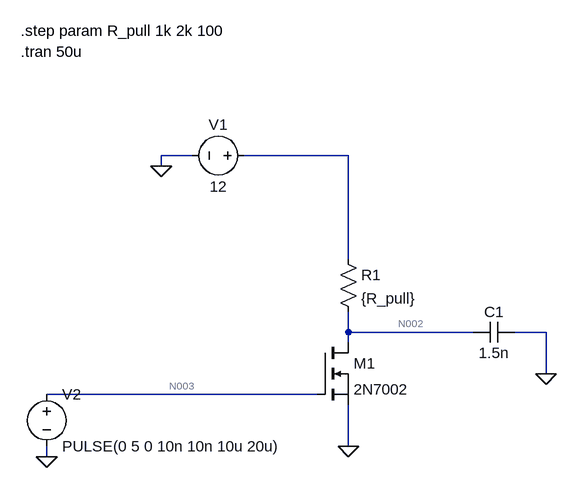
[diagram p0: schematic level_shifter.asc]
level_shifter.asc, the LTspice schematic file:
Version 4.1
SHEET 1 880 680
WIRE 0 64 -48 64
WIRE 240 64 80 64
WIRE -48 80 -48 64
WIRE 240 224 240 64
WIRE 240 336 240 304
WIRE 432 336 240 336
WIRE 544 336 496 336
WIRE 240 352 240 336
WIRE 544 400 544 336
WIRE 192 432 -224 432
WIRE 240 512 240 448
WIRE -224 528 -224 512
FLAG -48 80 0
FLAG -224 528 0
FLAG 240 512 0
FLAG 544 400 0
SYMBOL voltage 96 64 R90
WINDOW 0 -32 56 VBottom 2
WINDOW 3 32 56 VTop 2
WINDOW 123 0 0 Left 0
WINDOW 39 0 0 Left 0
SYMATTR InstName V1
SYMATTR Value 12
SYMBOL voltage -224 416 R0
WINDOW 123 0 0 Left 0
WINDOW 39 0 0 Left 0
SYMATTR InstName V2
SYMATTR Value PULSE(0 5 0 10n 10n 10u 20u)
SYMBOL nmos 192 352 R0
SYMATTR InstName M1
SYMATTR Value 2N7002
SYMBOL res 224 208 R0
SYMATTR InstName R1
SYMATTR Value {R_pull}
SYMBOL cap 496 320 R90
WINDOW 0 0 32 VBottom 2
WINDOW 3 32 32 VTop 2
SYMATTR InstName C1
SYMATTR Value 1.5n
TEXT -264 -128 Left 2 !.step param R_pull 1k 2k 100
TEXT -264 -96 Left 2 !.tran 50u

The netlist it stands for:
* level_shifter.asc
V1 N001 0 12
V2 N003 0 PULSE(0 5 0 10n 10n 10u 20u)
M1 N002 N003 0 0 2N7002
R1 N001 N002 {R_pull}
C1 0 N002 1.5n
.model NMOS NMOS
.model PMOS PMOS
.lib standard.mos
.step param R_pull 1k 2k 100
.tran 50u
.backanno
.end

* Results of the author's LTspice run, read from the files saved beside the schematic
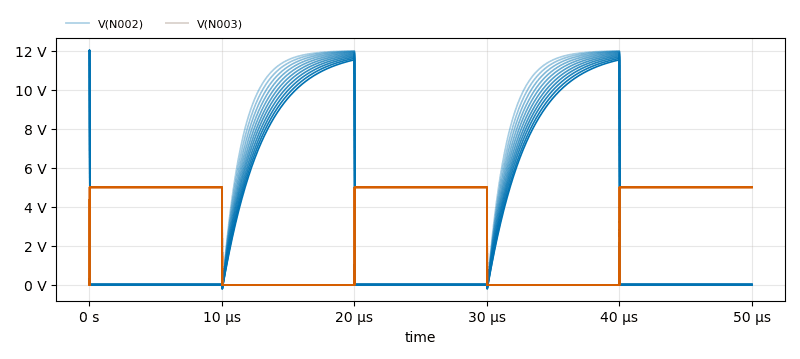
[diagram p1: Transient Analysis of level_shifter.asc, plotted from the saved traces]
* Transient Analysis, 11 runs:
*   V(N002) [r_pull=1000]: min -159.4 mV, max 12.01 V, average 4.07 V, rms 6.649 V, last 25.59 mV
*   V(N002) [r_pull=1100]: min -175.2 mV, max 12.01 V, average 3.994 V, rms 6.549 V, last 23.36 mV
*   V(N002) [r_pull=1200]: min -171.6 mV, max 12.01 V, average 3.92 V, rms 6.449 V, last 21.31 mV
*   V(N002) [r_pull=1300]: min -182.8 mV, max 12.01 V, average 3.846 V, rms 6.348 V, last 19.66 mV
*   V(N002) [r_pull=1400]: min -179.2 mV, max 12.01 V, average 3.773 V, rms 6.248 V, last 18.32 mV
*   V(N002) [r_pull=1500]: min -182.2 mV, max 12.01 V, average 3.701 V, rms 6.148 V, last 17.13 mV
*   V(N002) [r_pull=1600]: min -177.9 mV, max 12.01 V, average 3.632 V, rms 6.05 V, last 15.97 mV
*   V(N002) [r_pull=1700]: min -191.5 mV, max 12.01 V, average 3.563 V, rms 5.952 V, last 15.07 mV
*   V(N003) [r_pull=1000]: min 0 V, max 5 V, average 3.001 V, rms 3.874 V, last 5 V
*   V(N003) [r_pull=1100]: min 0 V, max 5 V, average 3.001 V, rms 3.874 V, last 5 V
*   V(N003) [r_pull=1200]: min 0 V, max 5 V, average 3.001 V, rms 3.874 V, last 5 V
*   V(N003) [r_pull=1300]: min 0 V, max 5 V, average 3.001 V, rms 3.874 V, last 5 V
*   V(N003) [r_pull=1400]: min 0 V, max 5 V, average 3.001 V, rms 3.874 V, last 5 V
*   V(N003) [r_pull=1500]: min 0 V, max 5 V, average 3.001 V, rms 3.874 V, last 5 V
*   V(N003) [r_pull=1600]: min 0 V, max 5 V, average 3.002 V, rms 3.874 V, last 5 V
*   V(N003) [r_pull=1700]: min 0 V, max 5 V, average 3.002 V, rms 3.874 V, last 5 V